# Altium schematic sheet GD32.SchDoc
size A4
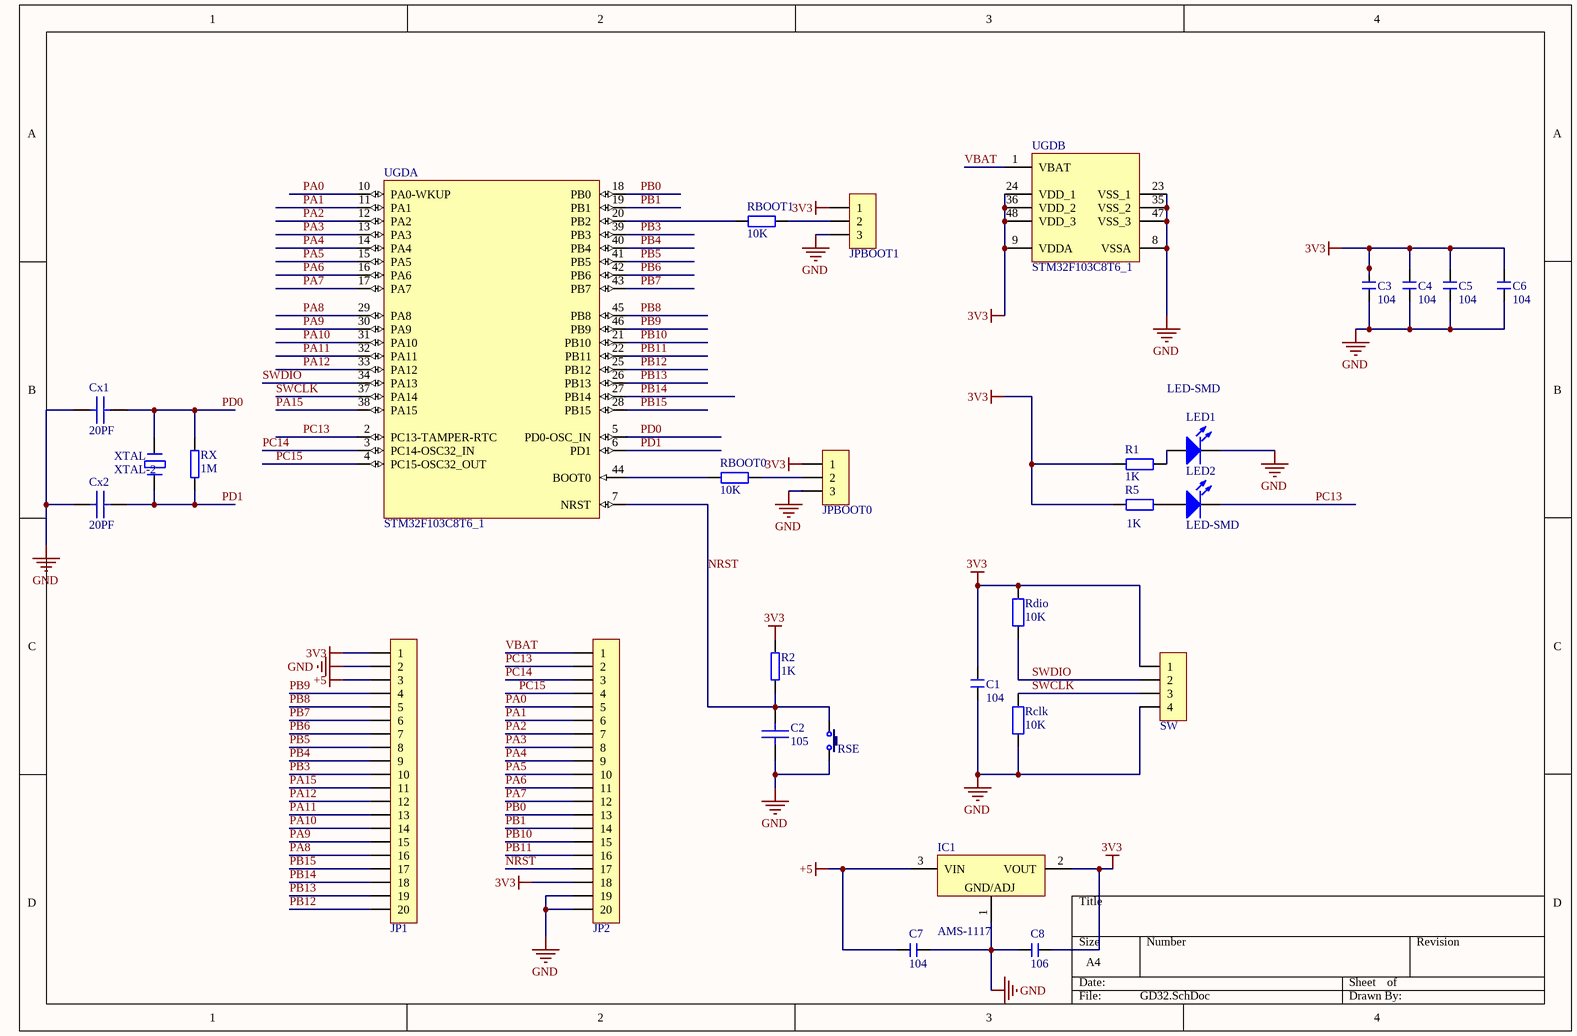
[diagram p0: GD32.SchDoc]

## Parts
C1  104  [C 0805]
C2  105  [LC-0805_C]
C3  104  [C 0805]
C4  104  [C 0805]
C5  104  [C 0805]
C6  104  [C 0805]
C7  104  [C 0805]
C8  106  [C 0805]
Cx1  20PF  [LC-0805_C]
Cx2  20PF  [LC-0805_C]
IC1  AMS-1117  [LC-SOT-223]
JP1  HDR-1X20  [HDR-1X20]  (value not drawn)
JP2  HDR-1X20  [HDR-1X20]  (value not drawn)
JPBOOT0  HDR-1X3  [HDR-1X3]  (value not drawn)
JPBOOT1  HDR-1X3  [HDR-1X3]  (value not drawn)
LED1  LED-SMD  [LC-0805_LED_S1]
LED2  LED-SMD  [LC-0805_LED_S1]
R1  1K  [R 0805]
R2  1K  [LC-0805_R]
R5  1K  [R 0805]
RBOOT0  10K  [R 0805]
RBOOT1  10K  [R 0805]
Rclk  10K  [R 0805]
Rdio  10K  [R 0805]
RSE  3x6x5  [TSW SMD-3*6*2.5]  (value not drawn)
RX  1M  [LC-0805_R]
SW  HDR-1X4  [HDR-1X4]  (value not drawn)
UGD  STM32F103C8T6_1  [LQFP48 7X7_M]  (parts A,B of 2)
XTAL  XTAL-2  [LC-HC-49S]

## Nets
3V3: C1.2 C3.2 C4.2 C5.2 C6.2 C8.2 IC1.2(VOUT) JP1.1 JP2.18 JPBOOT0.1 JPBOOT1.1 R1.1 R2.2 R5.1 Rdio.2 SW.1 UGD.9(VDDA) UGD.24(VDD_1) UGD.36(VDD_2) UGD.48(VDD_3)
+5: C7.1 IC1.3(VIN) JP1.3
GND: C1.1 C2.1 C3.1 C4.1 C5.1 C6.1 C7.2 C8.1 Cx1.1 Cx2.1 IC1.1(GND/ADJ) JP1.2 JP2.19 JP2.20 JPBOOT0.3 JPBOOT1.3 LED1.K Rclk.1 RSE.2 SW.4 UGD.8(VSSA) UGD.23(VSS_1) UGD.35(VSS_2) UGD.47(VSS_3)
NRST: C2.2 JP2.17 R2.1 RSE.1 UGD.7(NRST)
PA0: JP2.5 UGD.10(PA0-WKUP)
PA1: JP2.6 UGD.11(PA1)
PA2: JP2.7 UGD.12(PA2)
PA3: JP2.8 UGD.13(PA3)
PA4: JP2.9 UGD.14(PA4)
PA5: JP2.10 UGD.15(PA5)
PA6: JP2.11 UGD.16(PA6)
PA7: JP2.12 UGD.17(PA7)
PA8: JP1.16 UGD.29(PA8)
PA9: JP1.15 UGD.30(PA9)
PA10: JP1.14 UGD.31(PA10)
PA11: JP1.13 UGD.32(PA11)
PA12: JP1.12 UGD.33(PA12)
PA15: JP1.11 UGD.38(PA15)
PB0: JP2.13 UGD.18(PB0)
PB1: JP2.14 UGD.19(PB1)
PB3: JP1.10 UGD.39(PB3)
PB4: JP1.9 UGD.40(PB4)
PB5: JP1.8 UGD.41(PB5)
PB6: JP1.7 UGD.42(PB6)
PB7: JP1.6 UGD.43(PB7)
PB8: JP1.5 UGD.45(PB8)
PB9: JP1.4 UGD.46(PB9)
PB10: JP2.15 UGD.21(PB10)
PB11: JP2.16 UGD.22(PB11)
PB12: JP1.20 UGD.25(PB12)
PB13: JP1.19 UGD.26(PB13)
PB14: JP1.18 UGD.27(PB14)
PB15: JP1.17 UGD.28(PB15)
PC13: JP2.2 LED2.K UGD.2(PC13-TAMPER-RTC)
PC14: JP2.3 UGD.3(PC14-OSC32_IN)
PC15: JP2.4 UGD.4(PC15-OSC32_OUT)
PD0: Cx1.2 RX.2 UGD.5(PD0-OSC_IN) XTAL.2
PD1: Cx2.2 RX.1 UGD.6(PD1) XTAL.1
SWCLK: Rclk.2 SW.3 UGD.37(PA14)
SWDIO: Rdio.1 SW.2 UGD.34(PA13)
VBAT: JP2.1 UGD.1(VBAT)
NetJPBOOT0_2: JPBOOT0.2 RBOOT0.2
NetJPBOOT1_2: JPBOOT1.2 RBOOT1.2
NetLED1_A: LED1.A R1.2
NetLED2_A: LED2.A R5.2
NetRBOOT0_1: RBOOT0.1 UGD.44(BOOT0)
NetRBOOT1_1: RBOOT1.1 UGD.20(PB2)

## Library data of the parts
C1 C3-C8 = C: 无极性贴片电容; 版权归属: 源创客; BOM名称: 无极性贴片电容; 学习资源: www.ooocke.com
C2 Cx1 Cx2 = CAP-NPL-SMD: 贴片电容（无极性）
IC1 = AMS-1117: 线性稳压器
JP1 JP2 = Header 20: 20P接插件; 版权归属: 源创客; BOM名称: 20P接插件; 学习资源: www.ooocke.com
JPBOOT0 JPBOOT1 = Header 3: 3P接插件; 版权归属: 源创客; BOM名称: 3P接插件; 学习资源: www.ooocke.com
LED1 LED2 = LED-SMD: 贴片LED; Manufacturer: Generic Components; Class: Optoelectronic; SubClass: LED; Published: 08/06/2000; Publisher: Altium Hobart Technology Centre
R1 R5 RBOOT0 RBOOT1 Rclk Rdio = R: 贴片电阻; 版权归属: 源创客; BOM名称: 贴片电阻; 学习资源: www.ooocke.com
R2 RX = RES: 电阻
RSE = TSW 3x6: 3x6轻触开关; 版权归属: 源创客; BOM名称: 3x6轻触开关; 学习资源: www.ooocke.com
SW = Header 4: 4P接插件; 版权归属: 源创客; BOM名称: 4P接插件; 学习资源: www.ooocke.com
UGD = STM32F103C8T6_1: Flaah:64/RAM:20/IO:36; BOM名称: 32位STM单片机; 版权归属: 源创客; 学习资源: www.ooocke.com
XTAL = XTAL-2: 晶体振荡器